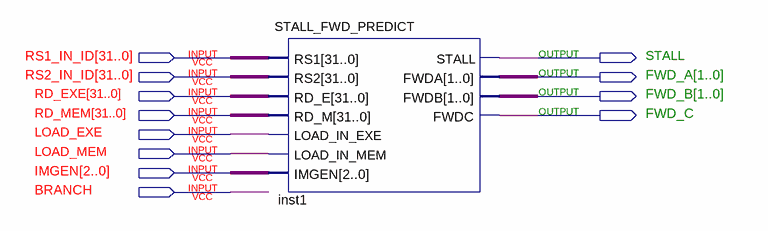
[diagram p0: schematic sheet]
// Quartus schematic STALL_FWD_PREDICTTEST.bdf as structural Verilog: 1 symbols, 12 pins
module STALL_FWD_PREDICTTEST (
  input  [31:0] RS1_IN_ID,
  input  [31:0] RS2_IN_ID,
  input  [31:0] RD_EXE,
  input  [31:0] RD_MEM,
  input  LOAD_EXE,
  input  LOAD_MEM,
  input  [2:0] IMGEN,
  input  BRANCH,
  output STALL,
  output [1:0] FWD_A,
  output [1:0] FWD_B,
  output FWD_C
);

  STALL_FWD_PREDICT inst1 (
    .RS1(RS1_IN_ID), .RS2(RS2_IN_ID), .RD_E(RD_EXE), .RD_M(RD_MEM), .LOAD_IN_EXE(LOAD_EXE),
    .LOAD_IN_MEM(LOAD_MEM), .IMGEN(IMGEN), .STALL(STALL), .FWDA(FWD_A), .FWDB(FWD_B), .FWDC(FWD_C));
endmodule
